# EAGLE design cell (EAGLE 7.6.0)
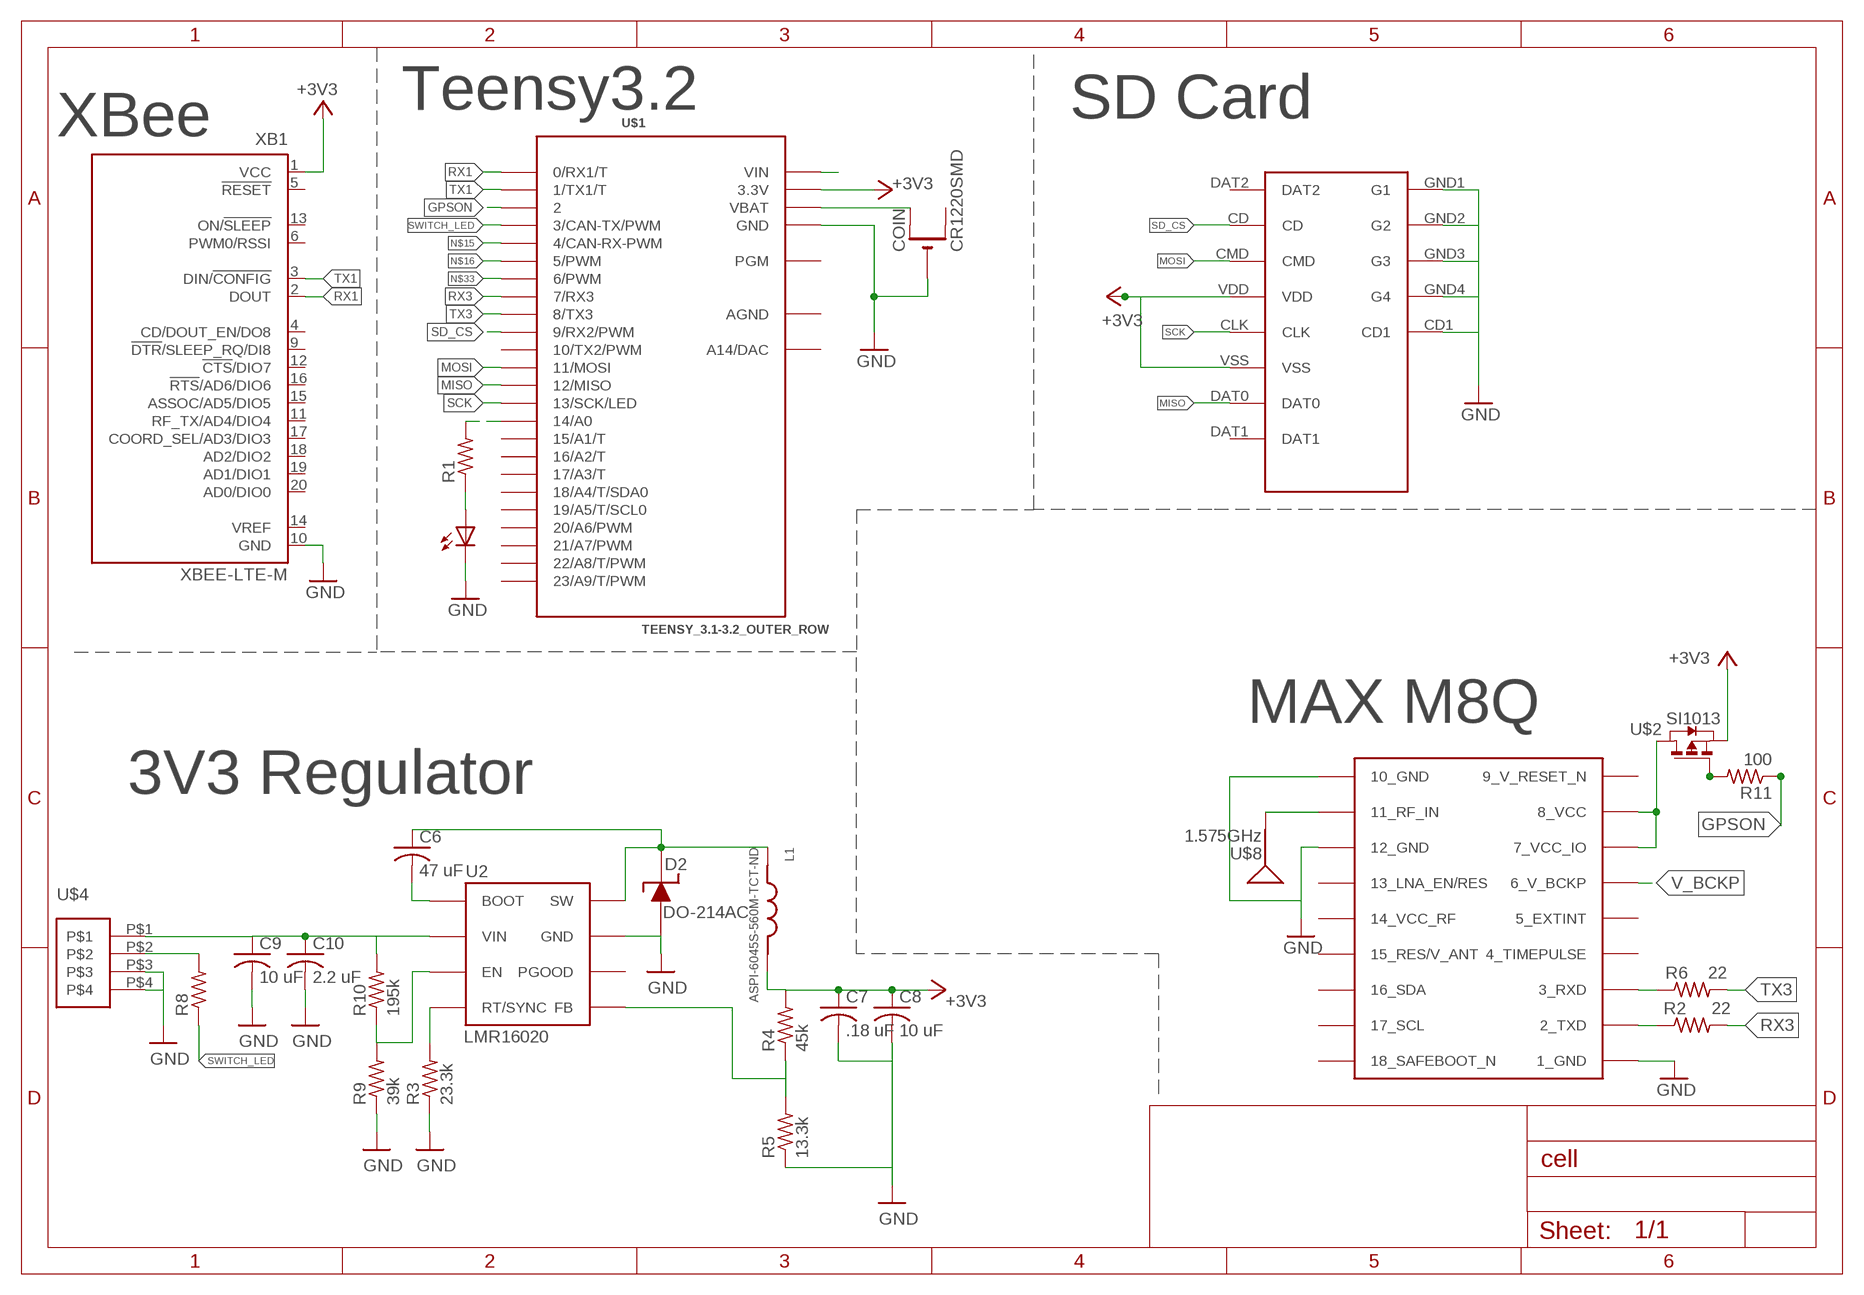
[diagram p0: schematic, sheet 1]

## Parts
C6  47 uF  C-USC0805  [C0805]
C7  .18 uF  C-USC0603  [C0603]
C8  10 uF  C-USC0603  [C0603]
C9  10 uF  C-USC1210  [C1210]
C10  2.2 uF  C-USC1210  [C1210]
COIN  CR1220SMD  CR1220SMT  [CR1220-SMD]
D2  DO-214AC  [DO-214AC]
L1  ASPI-6045S-560M-TCT-ND  [ABRACON]
LED1  Green  LEDCHIP-LED0603  [CHIP-LED0603]
R1  470  R-US_R0603  [R0603]
R2  22  R-US_R0603  [R0603]
R3  23.3k  R-US_R0603  [R0603]
R4  45k  R-US_R0603  [R0603]
R5  13.3k  R-US_R0603  [R0603]
R6  22  R-US_R0603  [R0603]
R8  R-US_R0603  [R0603]
R9  39k  R-US_R0603  [R0603]
R10  195k  R-US_R0603  [R0603]
R11  100  R-US_R0603  [R0603]
U2  LMR16020  [SO8]
U$1  TEENSY_3.1-3.2_OUTER_ROW  [TEENSY_3.0-3.2&LC_OUTER_ROW]
U$2  SI1013  [SC-75]
U$3  MICRO_SD  [MICRO_SD_HINGED]
U$4  MICROCLASP_4  [4_PIN_MICROCLASP]
U$7  MAX-M8  [MAX-M8]
U$8  1.575GHz  SPARKFUN-GPS_ANTENNAGPS-2X7MM  [SPARKFUN-GPS_ANT-GPS-2X7MM]
XB1  XBEE-LTE-M  XBEE-PRO  [XBEE-PRO]

## Nets
+3V3: C7.1 C8.1 L1.P$2 R4.2 U$1.3.3V U$1.3.3V1(3.3V) U$2.P$2(S) U$3.VDD U$3.VSS XB1.1(VCC)
EN: R9.2 R10.1 U2.P$3(EN)
FB: R4.1 R5.2 U2.P$5(FB)
GND: C7.2 C8.2 C9.2 C10.2 COIN.- D2.P$1 LED1.C R3.1 R5.1 R9.1 U2.P$7(GND) U2.PAD(GND) U$1.GND U$1.GND1(GND) U$3.CD1 U$3.GND1(G1) U$3.GND2(G2) U$3.GND3(G3) U$3.GND4(G4) U$4.P$3 U$4.P$4 U$7.1_GND U$7.10_GND U$7.12_GND XB1.10(GND)
GPSON: R11.1 U$1.2
MISO: U$1.12(12/MISO) U$3.DAT0
MOSI: U$1.11(11/MOSI) U$3.CMD
N$1: U$7.11_RF_IN U$8.1(SIGNAL)
N$2: R1.2 U$1.14/A0
N$3: R6.1 U$7.3_RXD
N$4: R2.1 U$7.2_TXD
N$5: R11.2 U$2.P$1(G)
N$6: U$1.VIN
N$8: R3.2 U2.P$4(RT/SYNC)
N$9: C6.2 U2.P$1(BOOT)
N$10: LED1.A R1.1
N$11: U$2.P$3(D) U$7.7_VCC_IO U$7.8_VCC
N$13: R8.2 U$4.P$2
N$15: U$1.4(4/CAN-RX-PWM)
N$16: U$1.5(5/PWM)
N$33: U$1.6(6/PWM)
RX1: U$1.0(0/RX1/T) XB1.2(DOUT)
RX3: R2.2 U$1.7(7/RX3)
SCK: U$1.13(13/SCK/LED) U$3.CLK
SD_CS: U$1.9(9/RX2/PWM) U$3.CD
SW: C6.1 D2.P$2 L1.P$1 U2.P$8(SW)
SWITCH_LED: R8.1 U$1.3(3/CAN-TX/PWM)
TX1: U$1.1(1/TX1/T) XB1.3(DIN/!CONFIG)
TX3: R6.2 U$1.8(8/TX3)
V_BCKP: COIN.+$1(+) U$1.VBAT U$7.6_V_BCKP
VIN: C9.1 C10.1 R10.2 U2.P$2(VIN) U$4.P$1
Unconnected: COIN.+$2(+1) U2.P$6(PGOOD) U$1.10(10/TX2/PWM) U$1.15/A1(15/A1/T) U$1.16/A2(16/A2/T) U$1.17/A3(17/A3/T) U$1.18/A4(18/A4/T/SDA0) U$1.19/A5(19/A5/T/SCL0) U$1.20/A6(20/A6/PWM) U$1.21/A7(21/A7/PWM) U$1.22/A8(22/A8/T/PWM) U$1.23/A9(23/A9/T/PWM) U$1.PGM U$1.RESET/DAC(A14/DAC) U$3.DAT1 U$3.DAT2 U$7.4_TIMEPULSE U$7.5_EXTINT U$7.13_LNA_EN(13_LNA_EN/RES) U$7.14_VCC_RF U$7.15_V_ANT/RESERVED(15_RES/V_ANT) U$7.16_SDA U$7.17_SCL U$7.18_SAFEBOOT_N XB1.4(CD/DOUT_EN/DO8) XB1.5(!RESET) XB1.6(PWM0/RSSI) XB1.9(!DTR!/SLEEP_RQ/DI8) XB1.11(RF_TX/AD4/DIO4) XB1.12(!CTS!/DIO7) XB1.13(ON/!SLEEP) XB1.14(VREF) XB1.15(ASSOC/AD5/DIO5) XB1.16(!RTS!/AD6/DIO6) XB1.17(COORD_SEL/AD3/DIO3) XB1.18(AD2/DIO2) XB1.19(AD1/DIO1) XB1.20(AD0/DIO0)

## Notes on the sheet
- Teensy3.2 | SD Card
- XBee
- MAX M8Q
- 3V3 Regulator

## Power pins joined to a net without a drawn wire
9_V_RESET_N: U$7.9_RESET_N(9_V_RESET_N)
AGND: U$1.AGND

## Library data of the parts
C6-C10 = resistor:C-US: CAPACITOR, American symbol
COIN = adafruit:CR1220: CR1216/CR1220/CR1225 12mm 3V lithium coin cell Great for battery packup. Both SMT and THM holders. Note the THM package has the ground pads on both sides of the PCB so that the masks are the same - this reduces the cost
D2 = HASP:DO-214AC
L1 = inductors:ASPI-6045S-560M-TCT-ND
LED1 = led:LED: LED OSRAM: - CHIPLED LG R971, LG N971, LY N971, LG Q971, LY Q971, LO R971, LY R971 LH N974, LH R974 LS Q976, LO Q976, LY Q976 LO Q996 - Hyper CHIPLED LW Q18S LB Q993, LB Q99A, LB R99A - SideLED LS A670, LO A670, LY A670, LG A670, LP A670 LB A673, LV A673, LT A673, LW A673 LH A674 LY A675 LS A676, LA A676, LO A676, LY A676, LW A676 LS A679, LY A679, LG A679 - Hyper Micro SIDELED® LS Y876, LA Y876, LO Y876, LY Y876 LT Y87S - SmartLED LW L88C, LW L88S LB L89C, LB L89S, LG L890 LS L89K, LO L89K, LY L89K LS L896, LA L896, LO L896, LY L896 - TOPLED LS T670, LO T670, LY T670, LG T670, LP T670 LSG T670, LSP T670, LSY T670, LOP T670, LYG T670 LG T671, LOG T671, LSG T671 LB T673, LV T673, LT T673, LW T673 LH T674 LS T676, LA T676, LO T676, LY T676, LB T676, LH T676, LSB T676, LW T676 LB T67C, LV T67C, LT T67C, LS T67K, LO T67K, LY T67K, LW E67C LS E67B, LA E67B, LO E67B, LY E67B, LB E67C, LV E67C, LT E67C LW T67C LS T679, LY T679, LG T679 LS T770, LO T770, LY T770, LG T770, LP T770 LB T773, LV T773, LT T773, LW T773 LH T774 LS E675, LA E675, LY E675, LS T675 LS T776, LA T776, LO T776, LY T776, LB T776 LHGB T686 LT T68C, LB T68C - Hyper Mini TOPLED® LB M676 - Mini TOPLED Santana® LG M470 LS M47K, LO M47K, LY M47K Source: http://www.osram.convergy.de LUXEON: - LUMILED® LXK2-PW12-R00, LXK2-PW12-S00, LXK2-PW14-U00, LXK2-PW14-V00 LXK2-PM12-R00, LXK2-PM12-S00, LXK2-PM14-U00 LXK2-PE12-Q00, LXK2-PE12-R00, LXK2-PE12-S00, LXK2-PE14-T00, LXK2-PE14-U00 LXK2-PB12-K00, LXK2-PB12-L00, LXK2-PB12-M00, LXK2-PB14-N00, LXK2-PB14-P00, LXK2-PB14-Q00 LXK2-PR12-L00, LXK2-PR12-M00, LXK2-PR14-Q00, LXK2-PR14-R00 LXK2-PD12-Q00, LXK2-PD12-R00, LXK2-PD12-S00 LXK2-PH12-R00, LXK2-PH12-S00 LXK2-PL12-P00, LXK2-PL12-Q00, LXK2-PL12-R00 Source: www.luxeon.com KINGBRIGHT: KA-3528ASYC Source: www.kingbright.com
R1 R3-R5 R8-R10 = resistor:R-US_: RESISTOR, American symbol
R2 R6 R11 = rcl:R-US_: RESISTOR, American symbol
U2 = HASP:LMR16020
U$1 = Teensy_3_and_LC_Series_Boards_v1.4:TEENSY_3.1-3.2_OUTER_ROW: Footprint for Teensy 3.1 or 3.2 board using all pin connections on the outer perimeter
U$2 = cmdLibs:SI1013: A PMOS that can be found in LTSPICE
U$3 = NR_connectors:MICRO_SD
U$4 = NR_connectors:MICROCLASP_4
U$7 = ubloxLib:MAX-M8: u-blox MAX GNSS module
U$8 = Tracksoar v2 :SPARKFUN-GPS_ANTENNA: Single-ended Antennae 1.575GHz antennae with just one terminal. These are all chip antennae. 1575MHz (GPS) Antennae ANT-GPS-2X7MM - 2.0 x 7.0 mm chip antenna. (SparkFun Product <https://www.sparkfun.com/products/9131>) ANT-GPS-2X8MM - 2.0 x 8.0 mm chip antenna. (SparkFun Product <https://www.sparkfun.com/products/8418>); PROD_ID: ANT-09087; SF_ID: GPS-09131
XB1 = maxstream:XBEE: XBee (TM) /XBee-PRO(TM) OEM RF Modules Source: MaxStream, Inc. xbee_productmanual.pdf; MPN: XBP24-AWI-001; OC_FARNELL: 1337916; OC_NEWARK: 42M2667

## Board
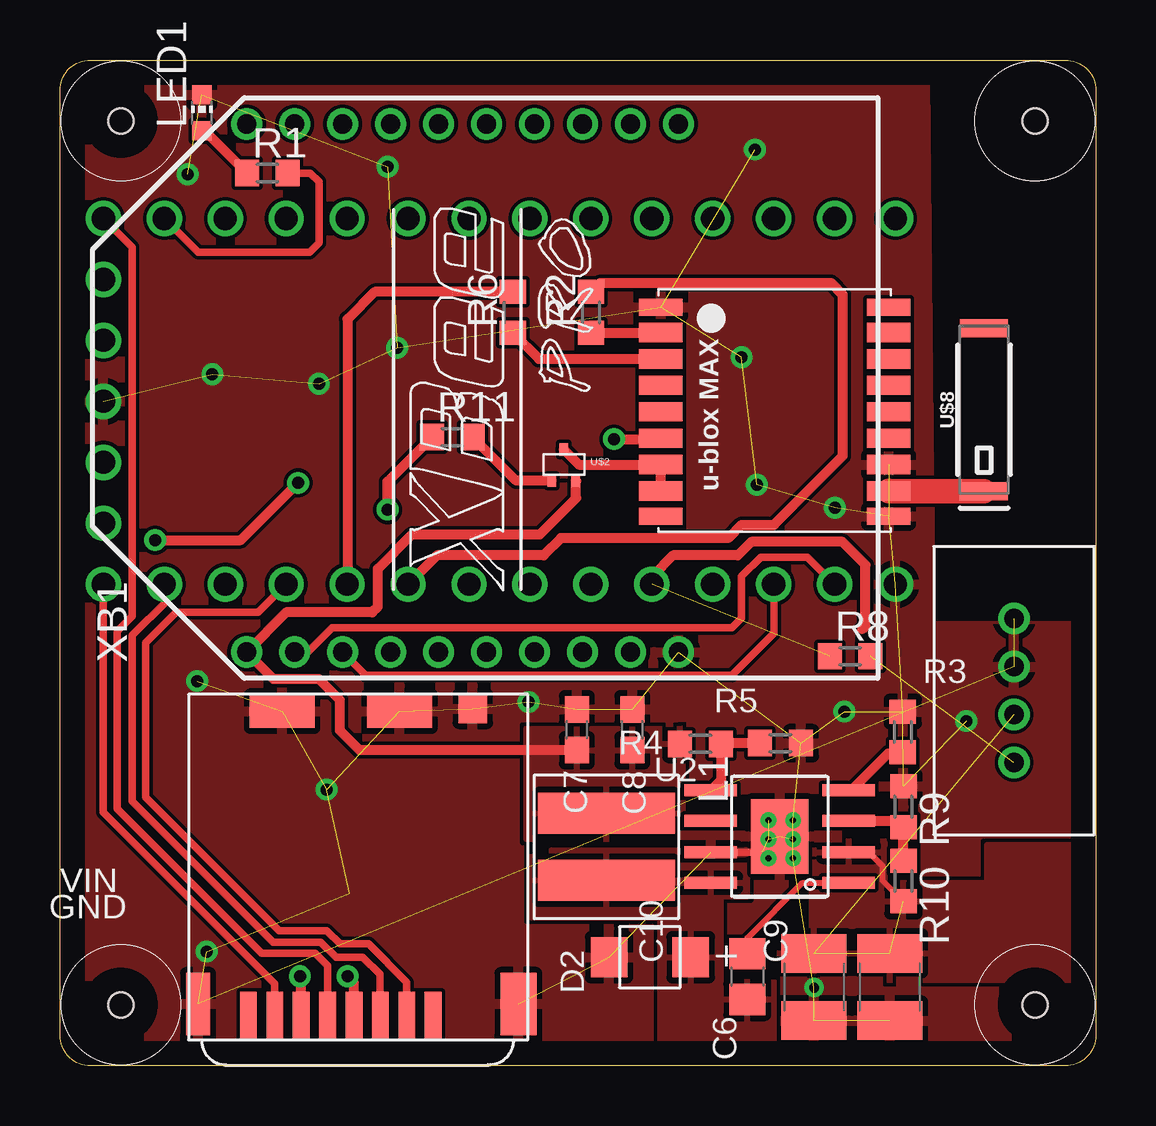
[diagram p1: board, top side]
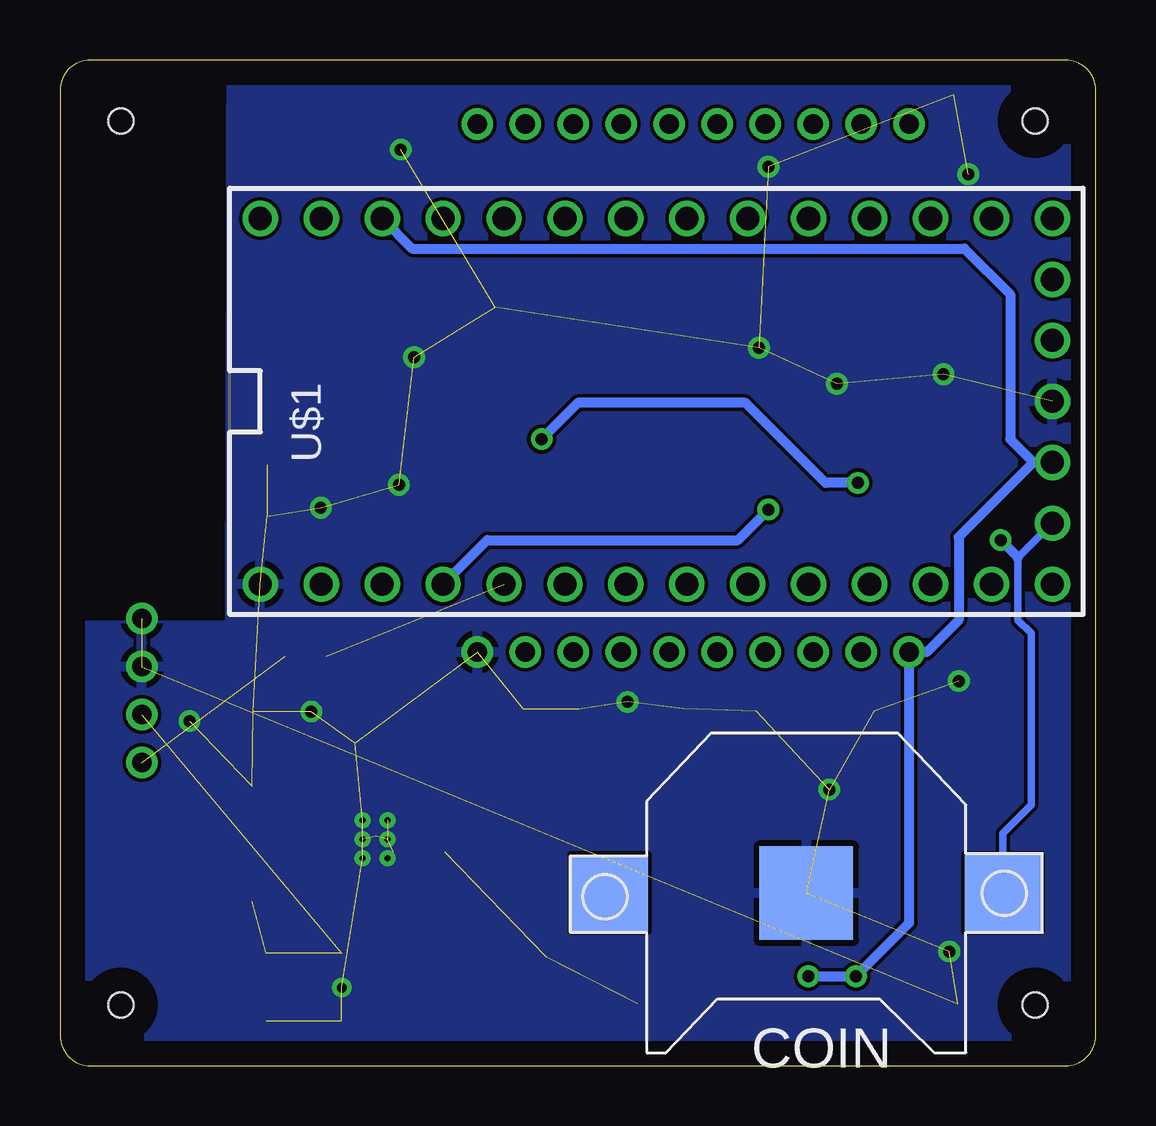
[diagram p2: board, bottom side, seen from below]

Size 43.18 x 41.91 mm. Coordinates in mm from the lower left corner, seen from the top.
Outline: 0,1.27 0,40.64 arc-90 1.27,41.91 41.91,41.91 arc-90 43.18,40.64 43.18,1.27 arc-90 41.91,0 1.27,0 arc-90 0,1.27
Copper layers (1*16): Top 0.035mm / dielectric 1.5mm / Bottom 0.035mm
Design rules "default": minimum track width 6mil, minimum drill 0.35mm, track to track 6mil, track to pad 6mil, pad to pad 6mil, via to via 6mil, smd to smd 6mil, copper to edge 40mil, drill to drill 6mil, minimum pad ring 10mil, minimum via ring 8mil, stop-mask expansion 4mil, vias tented up to drill 0mil, thermal gap 10mil
Holes 1.05 mm at 2.54,39.37 40.64,39.37 2.54,2.54 40.64,2.54

### Footprints (pad centres in the part's own frame; a part is rotated, then mirrored left to right if it is on the bottom)
C0805 = smd 1.3 x 1.5: 1 -0.95,0; 2 0.95,0
C0603 = smd 1.1 x 1: 1 -0.85,0; 2 0.85,0
C1210 = smd 1.6 x 2.7: 1 -1.4,0; 2 1.4,0
CR1220-SMD = smd 3.2 x 3.2: +$1 -8.2,0; +$2 8.2,0 | smd 3.9 x 3.9: - 0,0
DO-214AC = smd 1.524 x 1.676: P$1 -1.702,0; P$2 1.702,0
ABRACON = smd 1.7 x 5.7: P$1 1.4,0; P$2 -1.4,0
CHIP-LED0603 = smd 0.8 x 0.8: A 0,-0.75; C 0,0.75
R0603 = smd 1 x 1.1: 1 -0.85,0; 2 0.85,0
SO8 = smd 0.5 x 2.2: P$1 -1.92,-2.875; P$2 -0.65,-2.875; P$3 0.65,-2.875; P$4 1.92,-2.875; P$5 1.92,2.875; P$6 0.65,2.875; P$7 -0.65,2.875; P$8 -1.92,2.875 | smd 3.1 x 2.4: PAD 0,0
TEENSY_3.0-3.2&LC_OUTER_ROW = drill 0.965: 0 -7.62,13.97; 1 -7.62,11.43; 2 -7.62,8.89; 3 -7.62,6.35; 3.3V 7.62,11.43; 3.3V1 -2.54,-16.51; 4 -7.62,3.81; 5 -7.62,1.27; 6 -7.62,-1.27; 7 -7.62,-3.81; 8 -7.62,-6.35; 9 -7.62,-8.89; 10 -7.62,-11.43; 11 -7.62,-13.97; 12 -7.62,-16.51; 13 7.62,-16.51; 14/A0 7.62,-13.97; 15/A1 7.62,-11.43; 16/A2 7.62,-8.89; 17/A3 7.62,-6.35; 18/A4 7.62,-3.81; 19/A5 7.62,-1.27; 20/A6 7.62,1.27; 21/A7 7.62,3.81; 22/A8 7.62,6.35; 23/A9 7.62,8.89; AGND 7.62,13.97; GND -7.62,16.51; GND1 0,-16.51; PGM 2.54,-16.51; RESET/DAC 5.08,-16.51; VBAT -5.08,-16.51; VIN 7.62,16.51
SC-75 = smd 0.356 x 0.503: P$1 0.178,0.251; P$2 1.18,0.251; P$3 0.686,1.55
MICRO_SD_HINGED = smd 0.7 x 2: CD -1.1,-13.4; CLK -4.4,-13.4; CMD -2.2,-13.4; DAT0 -6.6,-13.4; DAT1 -7.7,-13.4; DAT2 0,-13.4; VDD -3.3,-13.4; VSS -5.5,-13.4 | smd 2.7 x 1.4: CD1 -1.4,-0.7; GND3 -6.3,-0.7 | smd 1.5 x 2.6: GND1 3.55,-12.9 | smd 1.2 x 1.2: GND2 1.65,-0.6 | smd 1 x 2.6: GND4 -9.8,-12.9
4_PIN_MICROCLASP = drill 0.8: P$1 -1,0; P$2 -3,0; P$3 1,0; P$4 3,0
MAX-M8 = smd 1.8 x 0.7: 1_GND 4.95,-4.4; 9_RESET_N 4.95,4.3; 10_GND -4.55,4.3; 18_SAFEBOOT_N -4.55,-4.4 | smd 1.8 x 0.8: 2_TXD 4.95,-3.35; 3_RXD 4.95,-2.25; 4_TIMEPULSE 4.95,-1.15; 5_EXTINT 4.95,-0.05; 6_V_BCKP 4.95,1.05; 7_VCC_IO 4.95,2.15; 8_VCC 4.95,3.25; 11_RF_IN -4.55,3.25; 12_GND -4.55,2.15; 13_LNA_EN -4.55,1.05; 14_VCC_RF -4.55,-0.05; 15_V_ANT/RESERVED -4.55,-1.15; 16_SDA -4.55,-2.25; 17_SCL -4.55,-3.35
SPARKFUN-GPS_ANT-GPS-2X7MM = smd 0.75 x 2: 1 -3.4,0; NC 3.4,0
XBEE-PRO = drill 0.8 pad 1.27: 1 -11,9; 2 -11,7; 3 -11,5; 4 -11,3; 5 -11,1; 6 -11,-1; 7 -11,-3; 8 -11,-5; 9 -11,-7; 10 -11,-9; 11 11,-9; 12 11,-7; 13 11,-5; 14 11,-3; 15 11,-1; 16 11,1; 17 11,3; 18 11,5; 19 11,7; 20 11,9

### Placement (x,y rotation side)
C6  28.65,3.71 90 top
C7  21.54,14 90 top
C8  23.86,14 90 top
C9  34.59,3.29 270 top
C10  31.43,3.29 270 top
COIN  12.07,7.2 180 bottom
D2  24.59,4.52 0 top
L1  22.78,9.13 270 top
LED1  5.92,39.71 0 top
R1  8.65,37.2 0 top
R2  22.13,31.39 90 top
R3  35.13,13.91 270 top
R4  26.7,13.41 180 top
R5  30.04,13.45 180 top
R6  18.87,31.39 90 top
R8  32.94,17.07 0 top
R9  35.16,10.79 270 top
R10  35.16,7.7 270 top
R11  16.35,26.19 0 top
U2  30,9.56 90 top
U$1  18.32,27.69 90 bottom
U$2  20.32,24.13 0 top
U$3  15.56,15.48 0 top
U$4  39.77,15.64 90 top
U$7  29.99,27.2 180 top
U$8  38.52,27.34 90 top
XB1  16.78,28.24 90 top

### Tracks (layer width: path | path; a pad name or v marks a point on that pad's centre or on a via)
+3V3  (via drill 0.5)
  Top 0.406: U$2.P$2 21.51,23.65 20,22.15 14.68,22.15 13.26,20.72 13.26,19.13 13.02,18.89 9.43,18.89 XB1.1 8.91,16.11 10.79,16.11 11.67,15.24 11.67,13.97 12.49,13.15 C7.1 | U$3.VSS 10.06,3.67 v10,3.73 | U$3.VDD 12.26,3.46 v11.99,3.73
  Bottom 0.406: U$1.3.3V 28.5,34.05 5.48,34.05 3.57,32.15 3.57,26.11 2.6,25.15 | 2.6,25.15 U$1.3.3V1 | 2.6,25.15 5.71,22.04 5.71,18.57 7.05,17.24 XB1.1 7.78,5.95 v10,3.73 v11.99,3.73
  pour Top (rank 3): 19.45,14.05 25.96,14.05 25.96,9.45 19.45,9.45
EN
  Top 0.406: U2.P$3 34.9,10.21 R9.2 R10.1
FB
  Top 0.406: U2.P$5 27.55,11.9 R4.1 27.58,13.45 R5.2
GND  (via drill 0.25, 0.41, 0.5)  (45 unrouted)
  Top 0.305: U2.P$7 29.27,8.91 v29.53,8.65
  other vias: 30.56,8.65 30.56,10.24 29.53,10.24 29.53,9.45 28.42,29.53 29.05,24.21 28.97,38.18 13.65,37.47 10.79,28.42 14.05,29.92 6.35,28.81 5.32,37.15 30.56,9.45 6.11,4.76 11.11,11.51 19.53,15.16 32.7,14.76 37.78,14.37 32.31,23.26 5.71,16.03 31.43,3.25
  pour Bottom (rank 6): -2.54,44.45 36.04,44.45 36.12,18.34 45.8,18.34 45.72,-2.54 -2.54,-2.54
  pour Top (rank 6): -1.27,43.18 36.04,43.18 36.27,18.34 44.69,18.34 44.45,-1.27 -1.27,-1.27
GPSON  (via drill 0.5)
  Top 0.406: 15.58,26.11 R11.1 13.65,24.34 v13.65,23.18
  Bottom 0.406: U$1.2 25.37,21.91 14.92,21.91 v13.65,23.18
MISO
  Top 0.305: U$3.DAT0 8.96,3.42 1.81,10.57 U$1.12
MOSI
  Top 0.305: U$1.11 4.45,19.97 4.45,19.37 3.02,17.94 3.02,11.03 8.89,5.16 10.87,5.16 11.51,4.52 12.62,4.52 13.34,3.81 13.34,2.1 U$3.CMD
N$1
  Top 1.016: U$7.11_RF_IN 34.55,23.94 U$8.1
N$2
  Top 0.305: R1.2 10.43,37.2 10.79,36.83 10.79,34.29 10.4,33.89 5.76,33.89 U$1.14/A0
N$3
  Top 0.406: R6.1 19.96,29.45 U$7.3_RXD
N$4
  Top 0.406: R2.1 22.14,30.55 U$7.2_TXD
N$5
  Top 0.406: 17.24,26.23 R11.2 19.01,24.38 U$2.P$1
N$8
  Top 0.406: U2.P$4 32.99,11.48 34.53,13.02 35.09,13.02 R3.2
N$9
  Top 0.254: C6.2 28.65,5.32 30.96,7.62 32.86,7.62 U2.P$1
N$10
  Top 0.406: LED1.A 6.04,38.96 R1.1
N$11
  Top 0.406: U$7.8_VCC U$7.7_VCC_IO | 24.83,25.27 U$7.7_VCC_IO | U$2.P$3 21.63,25.05 U$7.7_VCC_IO
N$13  (1 unrouted)
RX1
  Top 0.305: XB1.2 9.79,17.22 10.32,17.22 11.35,18.26 28.02,18.26 28.42,18.65 28.42,20.4 29.21,21.19 31.16,21.19 U$1.0
RX3
  Top 0.406: U$1.7 15.72,21.27 20.16,21.27 20.88,21.99 27.86,21.99 28.42,22.54 29.77,22.54 32.62,25.4 32.62,32.15 32.15,32.62 22.51,32.62 R2.2
SCK
  Top 0.305: U$1.13 3.02,34.1 3.02,18.73 2.38,18.1 2.38,10.72 8.41,4.68 10.64,4.68 11.16,4.16 U$3.CLK
SD_CS
  Top 0.305: U$1.9 8.26,18.89 4.84,18.89 3.57,17.62 3.57,11.19 9.13,5.64 11.11,5.64 11.67,5.08 12.86,5.08 14.46,3.48 U$3.CD
SW
  pour Top (rank 2): 20.48,8.73 20.08,8.73 19.61,8.73 19.61,6.19 25,6.19 25,0.79 29.77,0.79 29.77,3.49 27.54,3.49 27.54,7.06 28.65,7.06 28.65,8.33 25.8,8.33 25.8,8.97 20.48,8.97
SWITCH_LED  (1 unrouted)
  Top 0.406: 33.44,18.2 33.58,18.34 33.58,20.88 32.62,21.83 28.81,21.83 28.26,21.27 25.56,21.27 24.67,20.38 U$1.3
TX1
  Top 0.305: U$1.1 29.77,20.05 29.77,18.02 28.02,16.27 12.75,16.27 XB1.3
TX3
  Top 0.406: R6.2 13.12,32.24 11.99,31.11 11.99,20.08 U$1.8
V_BCKP  (via drill 0.5)
  Top 0.406: v3.97,21.91 7.54,21.91 v9.92,24.29 | v23.1,26.11 25,26.11 U$7.6_V_BCKP
  Bottom 0.305: COIN.+$1 3.87,9.7 2.7,10.87 2.7,18.02 3.25,18.57 3.25,21.16 U$1.VBAT
  Bottom 0.406: 3.25,21.16 3.25,21.19 v3.97,21.91 | v9.92,24.29 11.27,24.29 14.61,27.62 21.59,27.62 v23.1,26.11
VIN  (3 unrouted)
  Top 0.254: U2.P$2 33.72,8.91 34.29,8.33 34.29,7.72 R10.2
  pour Top: 38.66,9.21 43.42,9.21 43.42,3.57 30,3.57 30,5.79 31.35,5.79 31.35,9.37 34.37,9.37 34.37,7.62 38.66,7.62

### Text on the board
tPlace: Cell Tracker 3.0 | VIN | GND